# EAGLE design IrradiancePT_221211 (EAGLE 9.6.2)
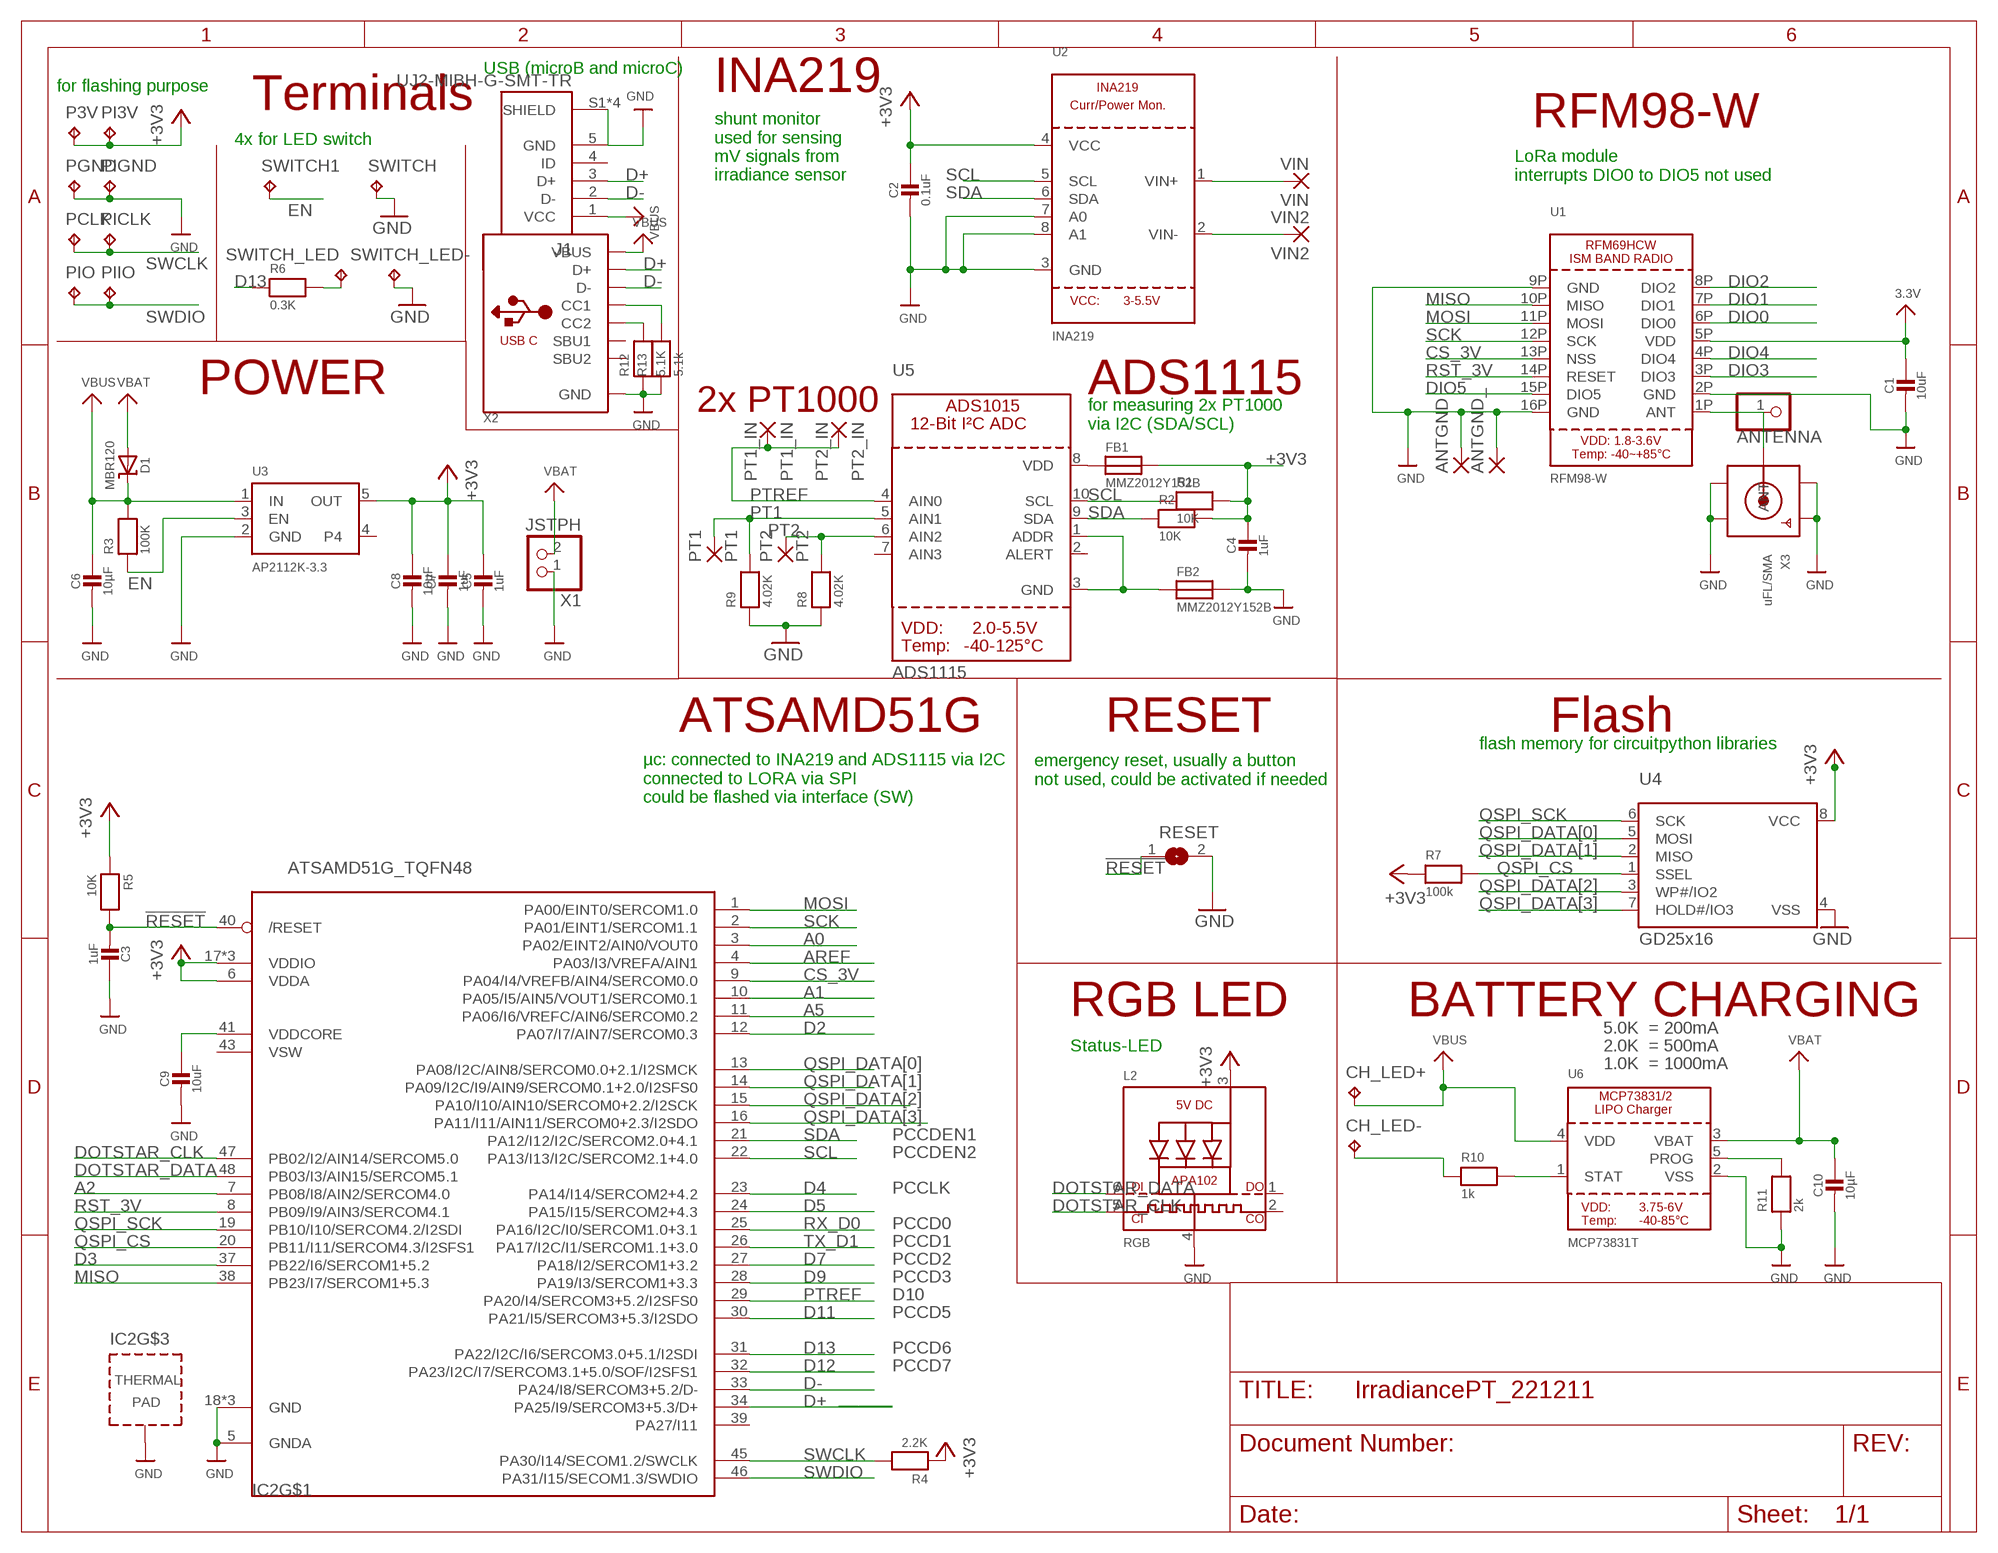
[diagram p0: schematic, sheet 1]

## Parts
ANTENNA  HEADER-1X1ROUND  [1X01_ROUND]
ANTGND  SMD5  [SMD2,54-5,08]
ANTGND_  SMD5  [SMD2,54-5,08]
C1  10uF  CAP_CERAMIC0805-NOOUTLINE  [0805-NO]
C2  0.1uF  CAP_CERAMIC0603_NO  [0603-NO]
C3  1uF  CAP_CERAMIC_0603MP  [_0603MP]
C4  1uF  CAP_CERAMIC0603_NO  [0603-NO]
C5  1uF  CAP_CERAMIC0603_NO  [0603-NO]
C6  10µF  CAP_CERAMIC0805-NOOUTLINE  [0805-NO]
C7  1uF  CAP_CERAMIC0603_NO  [0603-NO]
C8  10µF  CAP_CERAMIC0805-NOOUTLINE  [0805-NO]
C9  10uF  CAP_CERAMIC_0805MP  [_0805MP]
C10  10µF  CAP_CERAMIC0805-NOOUTLINE  [0805-NO]
CH_LED+  TPPAD1-13  [P1-13]
CH_LED-  TPPAD1-13  [P1-13]
D1  MBR120  DIODE-SCHOTTKYSOD-123  [SOD-123]
FB1  MMZ2012Y152B  FERRITE0805  [0805]
FB2  MMZ2012Y152B  FERRITE0805  [0805]
IC2  ATSAMD51G_TQFN48  [TQFN48_7MM]
J1  UJ2-MIBH-G-SMT-TR  [CUI_UJ2-MIBH-G-SMT-TR]
L2  RGB  APA1022020  [APA102_2020]
P3V  TPTP20R  [TP20R]
PCLK  TPTP20R  [TP20R]
PGND  TPTP20R  [TP20R]
PI3V  TPPAD1-13  [P1-13]
PICLK  TPPAD1-13  [P1-13]
PIGND  TPPAD1-13  [P1-13]
PIIO  TPPAD1-13  [P1-13]
PIO  TPTP20R  [TP20R]
PT1  PT1  1,6/0,9  [1,6/0,9]
PT1_IN  PT1_IN  1,6/0,9  [1,6/0,9]
PT2  PT2  1,6/0,9  [1,6/0,9]
PT2_IN  PT2_IN  1,6/0,9  [1,6/0,9]
R1  10K  RESISTOR0805  [0805]
R2  10K  RESISTOR0805  [0805]
R3  100K  RESISTOR0805  [0805]
R4  2.2K  RESISTOR0805  [0805]
R5  10K  RESISTOR0805  [0805]
R6  0.3K  RESISTOR0805  [0805]
R7  100k  RESISTOR0805  [0805]
R8  4.02K  RESISTOR0805  [0805]
R9  4.02K  RESISTOR0805  [0805]
R10  1k  RESISTOR0805  [0805]
R11  2k  RESISTOR0805  [0805]
R12  5.1K  RESISTOR0805  [0805]
R13  5.1k  RESISTOR0805  [0805]
RESET  SOLDERJUMPER  [SOLDERJUMPER_ARROW_NOPASTE]
SWITCH  TPPAD1-13  [P1-13]
SWITCH1  TPPAD1-13  [P1-13]
SWITCH_LED  TPPAD1-13  [P1-13]
SWITCH_LED-  TPPAD1-13  [P1-13]
U1  RFM98-W  RFM69HCW_SMT  [RFMHCW_SMT]
U2  INA219  [SOT23-8]
U3  AP2112K-3.3  VREG_SOT23-5  [SOT23-5]
U4  GD25x16  SPIFLASH_8PINUX  [USON8]
U5  ADS1115  ADC_ADS1015  [MSOP10]
U6  MCP73831T  MCP73831/2  [SOT23-5]
VIN  VIN  1,6/0,9  [1,6/0,9]
VIN2  VIN2  1,6/0,9  [1,6/0,9]
X1  JSTPH  CON_JST_PH_2PIN  [JSTPH2]
X2  USB_C  [USB_C_CUSB31-CFM2AX-01-X]
X3  uFL/SMA  SMACONNECTOR_EDGE_UFL  [SMA_EDGELAUNCH_UFL]

## Nets
!RESET: C3.2 IC2.40(/RESET) R5.2 RESET.1
+3V3: C1.1 C2.1 C4.1 C5.1 C7.1 C8.1 FB1.2 IC2.6(VDDA) IC2.17(VDDIO) IC2.36(VDDIO) IC2.44(VDDIO) L2.3(VDD) P3V.TP PI3V.TP R1.2 R2.2 R4.1 R5.1 R7.1 U1.5P(VDD) U2.4(VCC) U3.5(OUT) U4.8(VCC) ; supply symbol labelled 3.3V
A0: IC2.3(PA02/EINT2/AIN0/VOUT0)
A1: IC2.10(PA05/I5/AIN5/VOUT1/SERCOM0.1)
A2: IC2.7(PB08/I8/AIN2/SERCOM4.0)
A5: IC2.11(PA06/I6/VREFC/AIN6/SERCOM0.2)
AREF: IC2.4(PA03/I3/VREFA/AIN1)
CS_3V: IC2.9(PA04/I4/VREFB/AIN4/SERCOM0.0) U1.13P(NSS)
D2: IC2.12(PA07/I7/AIN7/SERCOM0.3)
D3: IC2.37(PB22/I6/SERCOM1+5.2)
D4: IC2.23(PA14/I14/SERCOM2+4.2)
D5: IC2.24(PA15/I15/SERCOM2+4.3)
D7: IC2.27(PA18/I2/SERCOM1+3.2)
D9: IC2.28(PA19/I3/SERCOM1+3.3)
D11: IC2.30(PA21/I5/SERCOM3+5.3/I2SDO)
D12: IC2.32(PA23/I2C/I7/SERCOM3.1+5.0/SOF/I2SFS1)
D13: IC2.31(PA22/I2C/I6/SERCOM3.0+5.1/I2SDI) R6.1
D+: IC2.34(PA25/I9/SERCOM3+5.3/D+) J1.3(D+) X2.A6(D+) X2.B6(D+)
D-: IC2.33(PA24/I8/SERCOM3+5.2/D-) J1.2(D-) X2.A7(D-) X2.B7(D-)
DIO0: U1.6P(DIO0)
DIO1: U1.7P(DIO1)
DIO2: U1.8P(DIO2)
DIO3: U1.3P(DIO3)
DIO4: U1.4P(DIO4)
DIO5: U1.15P(DIO5)
DOTSTAR_CLK: IC2.47(PB02/I2/AIN14/SERCOM5.0) L2.5(CKI)
DOTSTAR_DATA: IC2.48(PB03/I3/AIN15/SERCOM5.1) L2.6(DI)
EN: R3.1 SWITCH1.TP U3.3(EN)
GND: ANTGND.1(P) ANTGND_.1(P) C1.2 C2.2 C3.1 C4.2 C5.2 C6.2 C7.2 C8.2 C9.2 C10.2 FB2.2 IC2.5(GNDA) IC2.18(GND) IC2.35(GND) IC2.42(GND) IC2.THERMAL(TP) J1.5(GND) J1.S1(SHIELD) J1.S2(SHIELD) J1.S3(SHIELD) J1.S4(SHIELD) L2.4(GND) PGND.TP PIGND.TP R8.1 R9.1 R11.1 R12.1 R13.1 RESET.2 SWITCH.TP SWITCH_LED-.TP U1.2P(GND) U1.9P(GND) U1.16P(GND) U2.3(GND) U2.7(A0) U2.8(A1) U3.2(GND) U4.4(VSS) U6.2(VSS) X1.1 X2.A1B12(GND) X2.B1A12(GND) X3.GND@1(GND1) X3.GND@2(GND2) X3.GND@3(GND3) X3.GND@4(GND4)
GND_IN: FB2.1 U5.1(ADDR) U5.3(GND)
MISO: IC2.38(PB23/I7/SERCOM1+5.3) U1.10P(MISO)
MOSI: IC2.1(PA00/EINT0/SERCOM1.0) U1.11P(MOSI)
N$1: ANTENNA.1 U1.1P(ANT) X3.P(ANT)
N$2: R6.2 SWITCH_LED.TP
N$3: U2.1(VIN+) VIN.1(P)
N$4: U2.2(VIN-) VIN2.1(P)
N$5: FB1.1 U5.8(VDD)
N$6: CH_LED-.TP R10.1
N$7: R10.2 U6.1(STAT)
N$8: R11.2 U6.5(PROG)
N$9: R13.2 X2.A5(CC1)
N$10: R12.2 X2.B5(CC2)
PT1: PT1.1(P) R9.2 U5.5(AIN1)
PT2: PT2.1(P) R8.2 U5.6(AIN2)
PTREF: IC2.29(PA20/I4/SERCOM3+5.2/I2SFS0) PT1_IN.1(P) PT2_IN.1(P) U5.4(AIN0)
QSPI_CS: IC2.20(PB11/I11/SERCOM4.3/I2SFS1) R7.2 U4.1(SSEL)
QSPI_DATA[0]: IC2.13(PA08/I2C/AIN8/SERCOM0.0+2.1/I2SMCK) U4.5(MOSI)
QSPI_DATA[1]: IC2.14(PA09/I2C/I9/AIN9/SERCOM0.1+2.0/I2SFS0) U4.2(MISO)
QSPI_DATA[2]: IC2.15(PA10/I10/AIN10/SERCOM0+2.2/I2SCK) U4.3(WP#/IO2)
QSPI_DATA[3]: IC2.16(PA11/I11/AIN11/SERCOM0+2.3/I2SDO) U4.7(HOLD#/IO3)
QSPI_SCK: IC2.19(PB10/I10/SERCOM4.2/I2SDI) U4.6(SCK)
RST_3V: IC2.8(PB09/I9/AIN3/SERCOM4.1) U1.14P(RESET)
RX_D0: IC2.25(PA16/I2C/I0/SERCOM1.0+3.1)
SCK: IC2.2(PA01/EINT1/SERCOM1.1) U1.12P(SCK)
SCL: IC2.22(PA13/I13/I2C/SERCOM2.1+4.0) R1.1 U2.5(SCL) U5.10(SCL)
SDA: IC2.21(PA12/I12/I2C/SERCOM2.0+4.1) R2.1 U2.6(SDA) U5.9(SDA)
SWCLK: IC2.45(PA30/I14/SECOM1.2/SWCLK) PCLK.TP PICLK.TP R4.2
SWDIO: IC2.46(PA31/I15/SECOM1.3/SWDIO) PIIO.TP PIO.TP
TX_D1: IC2.26(PA17/I2C/I1/SERCOM1.1+3.0)
VBAT: C10.1 D1.A U6.3(VBAT) X1.2
VBUS: C6.1 CH_LED+.TP D1.C J1.1(VCC) R3.2 U3.1(IN) U6.4(VDD) X2.A4B9(VBUS) X2.B4A9(VBUS)
VDDCORE: C9.1 IC2.41(VDDCORE)
Unconnected: IC2.39(PA27/I11) J1.4(ID) L2.1(DO) L2.2(CKO) U3.4 U5.2(ALERT) U5.7(AIN3) X2.A8(SBU1) X2.B8(SBU2)

## Notes on the sheet
- USB (microB and microC)
- for flashing purpose | INA219
- Terminals
- RFM98-W
- 4x for LED switch
- shunt monitor
  used for sensing
  mV signals from
  irradiance sensor
- LoRa module
  interrupts DIO0 to DIO5 not used
- POWER | ADS1115
- 2x PT1000
- for measuring 2x PT1000
  via I2C (SDA/SCL)
- ATSAMD51G | RESET | Flash
- flash memory for circuitpython libraries
- emergency reset, usually a button
  not used, could be activated if needed
- µc: connected to INA219 and ADS1115 via I2C
  connected to LORA via SPI
  could be flashed via interface (SW)
- RGB LED | BATTERY CHARGING
- 5.0K  = 200mA
- Status-LED | 2.0K  = 500mA
- 1.0K  = 1000mA
- PCCDEN1
- PCCDEN2
- PCCLK
- PCCD0
- PCCD1
- PCCD2
- PCCD3
- D10
- PCCD5
- PCCD6
- PCCD7

## Power pins joined to a net without a drawn wire
VSW: IC2.43(VSW)

## Library data of the parts
ANTENNA = microbuilder:HEADER-1X1: PIN HEADER
ANTGND ANTGND_ = wirepad:SMD5: SMD PAD
C1-C10 = microbuilder:CAP_CERAMIC: Ceramic Capacitors For new designs, use the packages preceded by an '_' character since they are more reliable: The following footprints should be used on most boards: _0402 - Standard footprint for regular board layouts _0603 - Standard footprint for regular board layouts _0805 - Standard footprint for regular board layouts _1206 - Standard footprint for regular board layouts For extremely tight-pitch boards where space is at a premium, the following 'micro-pitch' footprints can be used (smaller pads, no silkscreen outline, etc.): _0402MP - Micro-pitch footprint for very dense/compact boards _0603MP - Micro-pitch footprint for very dense/compact boards _0805MP - Micro-pitch footprint for very dense/compact boards _1206MP - Micro-pitch footprint for very dense/compact boards
CH_LED+ CH_LED- P3V PCLK PGND PI3V PICLK PIGND PIIO PIO SWITCH SWITCH1 SWITCH_LED SWITCH_LED- = testpad:TP: Test pad
D1 = microbuilder:DIODE-SCHOTTKY
FB1 FB2 = microbuilder:FERRITE: Ferrite Bead 0603 MMZ1608B121C - 120 Ohm, 600mA Ferrite Chip - Digikey: 445-2164-1-ND BK1608HW121-T - 120 Ohm, 600mA Ferrite Chip - Digikey: 587-1876-2-ND 0805 HZ0805B272R-10 - 2.7K Ohm @ 100MHz, 200mA 0.8 Ohm DC Resistance - Digikey: 240-2504-1-ND (see also Murata BLM21BD272SN1L)
IC2 = microbuilder:ATSAMD51G
J1 = cui-uj2:UJ2-MIBH-G-SMT-TR: USB micro B type receptacle; MANUFACTURER: CUI; MAXIMUM_PACKAGE_HEIGHT: 2.95 mm; PARTREV: 1.0; STANDARD: Manufacturer Recommendations
L2 = microbuilder:APA102: APA102/DotStar Pixels VCC: 5V DC Refresh Rate: 400Hz
PT1 PT1_IN PT2 PT2_IN VIN VIN2 = wirepad:1,6/0,9: THROUGH-HOLE PAD
R1-R13 = microbuilder:RESISTOR: Resistors 0402 - 0402 Surface Mount Package 22 Ohm 1% 1/16W [Digikey: 311-22.0LRTR-ND] 33 Ohm 5% 1/16W 1.0K 5% 1/16W 1.5K 5% 1/16W 2.0K 1% 1/16W 10.0K 1% 1/16W [Digikey: 311-10.0KLRTR-ND] 10.0K 5% 1/16W [Digikey: RMCF0402JT10K0TR-ND] 12.1K 1% 1/16W [Digikey: 311-22.0LRTR-ND] 100.0K 5% 1/16W 0603 - 0603 Surface Mount Package 0 Ohm 1/10 Watt 1% Resistor 15 Ohm 1/10 Watt 1% Resistor 33 Ohm 1/10 Watt 1% Resistor 49.9 Ohm 1/10 Watt 1% Resistor 100 Ohm 1/10 Watt 1% Resistor 150 Ohm 1/10 Watt 1% Resistor 240 Ohm 1/10 Watt 1% Resistor 390 Ohm 1/10 Watt 1% Resistor 560 Ohm 1/10 Watt 1% Resistor 680 Ohm 1/10 Watt 1% Resistor 750 Ohm 1/10 Watt 1% Resistor 1.0K Ohm 1/10 Watt 1% Resistor 1.5K Ohm 1/10 Watt 1% Resistor 2.0K Ohm 1/10 Watt 1% Resistor 2.2K Ohm 1/10 Watt 1% Resistor 3.3K Ohm 1/10 Watt 1% Resistor 4.7K Ohm 1/10 Watt 1% Resistor 10.0K Ohm 1/10 Watt 1% Resistor 12.0K Ohm 1/10 Watt 1% Resistor 12.1K Ohm 1/10 Watt 1% Resistor 20.0K Ohm 1/10 Watt 1% Resistor 33.0K Ohm 1/10 Watt 1% Resistor 100.0K Ohm 1/10 Watt 1% Resistor 0805 - 0805 Surface Mount Package 0 Ohm 1/8 Watt 1% Resistor 33 Ohm 1/8 Watt 1% Resistor 100 Ohm 1/8 Watt 1% Resistor 150 Ohm 1/8 Watt 1% Resistor 200 Ohm 1/8 Watt 1% Resistor 240 Ohm 1/8 Watt 1% Resistor 330 Ohm 1/8 Watt 1% Resistor 390 Ohm 1/8 Watt 1% Resistor 470 Ohm 1/8 Watt 1% Resistor 1.0K Ohm 1/8 Watt 1% Resistor 1.5K Ohm 1/8 Watt 1% Resistor 2.0K Ohm 1/8 Watt 1% Resistor 4.7K Ohm 1/8 Watt 1% Resistor 5.1K Ohm 1/8 Watt 1% Resistor 5.6K Ohm 1/8 Watt 1% Resistor 10.0K Ohm 1/8 Watt 1% Resistor 22.0K Ohm 1/8 Watt 1% Resistor 33.0K Ohm 1/8 Watt 1% Resistor 100K Ohm 1/8 Watt 1% Resistor 1206 - 1206 Surface Mount Package 2012 - 2010 Surface Mount Package 0.11 Ohm 1/2 Watt 1% Resistor - Digikey: RHM.11UCT-ND
RESET = microbuilder:SOLDERJUMPER: SMD Solder JUMPER Solder the two pads together to create a connection, or remove the solder to break it. REFLOW - Use this footprint for solder paste and reflow ovens. WAVE - Use this footprint for hand-soldering (larger pads). CLOSED - Has a trace between the two pads to ensure it is closed by default. The trace needs to be cut to disable the jumper, and can be closed again by creating a solder bridge between the two pads.; BOM: EXCLUDE
U1 = microbuilder:RFM69HCW: RFM69HCW - ISM Band RF Transceiver
U2 = microbuilder:INA219: INA219 - I2C Current/Power Monitor Voltage Range: 0-26V Accuracy: 0.5% Temperature: -40°C - 125°C
U3 = microbuilder:VREG_SOT23-5: SOT23-5 Fixed Voltage Regulators Part Current Out V Out V In V Dropout θJA (°C/W) TJ (°C) Digikey Part No. ADP121 150mA 3.3V 3.4-5.5V 0.09V @ 150mA -- -- ADP121-AUJZ33R7CT-ND ADP121 150mA 3.0V 3.1-5.5V 0.09V @ 150mA -- -- ADP121-AUJZ30R7CT-ND ADP122 300mA 3.3V 3.4-5.5V 0.085V @ 300mA -- -- ADP122AUJZ-3.3-R7CT-ND ADP1712 300mA 3.3V 3.5-5.5V 0.17V @ 300mA -- -- ADP1712AUJZ-3.3-R7TR-ND AP7311 (Low Cost) 150mA 3.3V 3.5-6V 0.15V @ 150mA -- -- AP7311-33WG-7DICT-ND LD39015M18R 150mA 1.8V 1.9V-5.5V 0.08V @ 100mA -- -- 497-6977-1-ND LP2985A-33DBVR 150mA 3.3V 3.3-16V 0.28V @ 150mA 206 150 296-18479-1-ND MCP1824T-3302E/OT 300mA 3.3V 3.5V-6V 0.2V @ 300mA -- -- MCP1824T-3302E/OTCT-ND MIC5205-2.5YM5 TR 150mA 2.5V 2.7-16V 0.165V @ 150mA -- -- 576-1257-2-ND MIC5205-3.0YM5 TR 150mA 3.0V 3.2V-16V 0.165V @ 150mA -- -- 576-1258-2-ND MIC5205-3.3YM5 TR 150mA 3.3V 3.5V-16V 0.165V @ 150mA -- -- 576-1259-2-ND TPS780330220 150mA 3.3V+2.2V 3.6-5.5V 250mV Max -- -- 296-23332-1-ND TDA3663/N1,135 100mA 3.3V 3.5-45V 0.18V @ 50mA -- -- 568-5343-1-ND Max operating temp can be calculated using θJA, TJ (max junction temperature), and power in watts. Set the "Maximum Ambient Temperature" until it reaches TJ ("Max Junction Temperature"), which is the absolute limit for safe use of the regulator: Heat Sink Temperature Calculator <http://www.daycounter.com/Calculators/Heat-Sink-Temperature-Calculator.phtml> For example, With 12V source into a 3.3V LP2985 and a 30mA load, we are dissipating (12V-3.3V) * 0.03A = 0.261W. With a θJA of 206 °C/W, a TJ of 150°C, and 261mW we can safely use the chip without a heat sink up to 75°C (=147.1°C Junction Temperature).
U4 = microbuilder:SPIFLASH_8PIN: SOIC8 SPI Flash Be careful with the size since SOIC8 flash comes in several 'widths' SOIC8 150 mil M25P16 - 16Mbit (2Mbit x 8) Serial Flash (75MHz SPI Bus), Supply: 2.7-3.6V Digikey: SOIC8 - M25P16-VMN6P-ND SOIC8 208 mil W25Q16BVSSIG - 16Mbit (2Mbit x 8) Serial Flash (104MHz SPI Bus), Supply: 2.7-3.6V Digikey: SOIC8 - W25Q16BVSSIG-ND
U5 = microbuilder:ADC_ADS1015: ADS1015 - 12-bit 4-Channel I2C ADC with Internal PGA VDD: 2.0-5.5V Sampling Rate: 3.3ksps Gain Settings: 2/3, 1, 2, 4, 8, 16 I2C Address: ADDR low = 1001000x, ADDR high = 1001001x Internal Comparator The ADS1015 includes an internal comparator that can be set to output a high-level on ALERT when the conversion results exceeeds a pre-defined upper level, and will deassert itself when the level falls below a pre-defined lower threshold level. It can also be set to windowed mode where the ALERT pin will be asserted if the data exceeds the upper threshold or falls below the lower threshold.
U6 = microbuilder:MCP73831/2: MCP73831/2 LIPO Charger VDD: 3.75 - 6V Temp -40 - 85°C Programmable Charge Rate: 15-500mA NOTE: STAT is a tri-state logic output on the MCP73831 and an open-drain output on the MCP73832. SOT23-5 with 4.2V output and tri-state logic on STAT = MCP73831T-2ACI/OT
X1 = microbuilder:CON_JST_PH_2PIN: JST 2-Pin Right-Angle Connector PH-Series - 4UConnector: 17311 SH-Series - 4UConnector: 07278
X2 = microbuilder:USB_C: USB Type-C USB 2.0 Connector
X3 = microbuilder:SMACONNECTOR: SMA Connector 90° DIP SMA Connector, 50 Ohm (4UConnector: 07259)

## Board
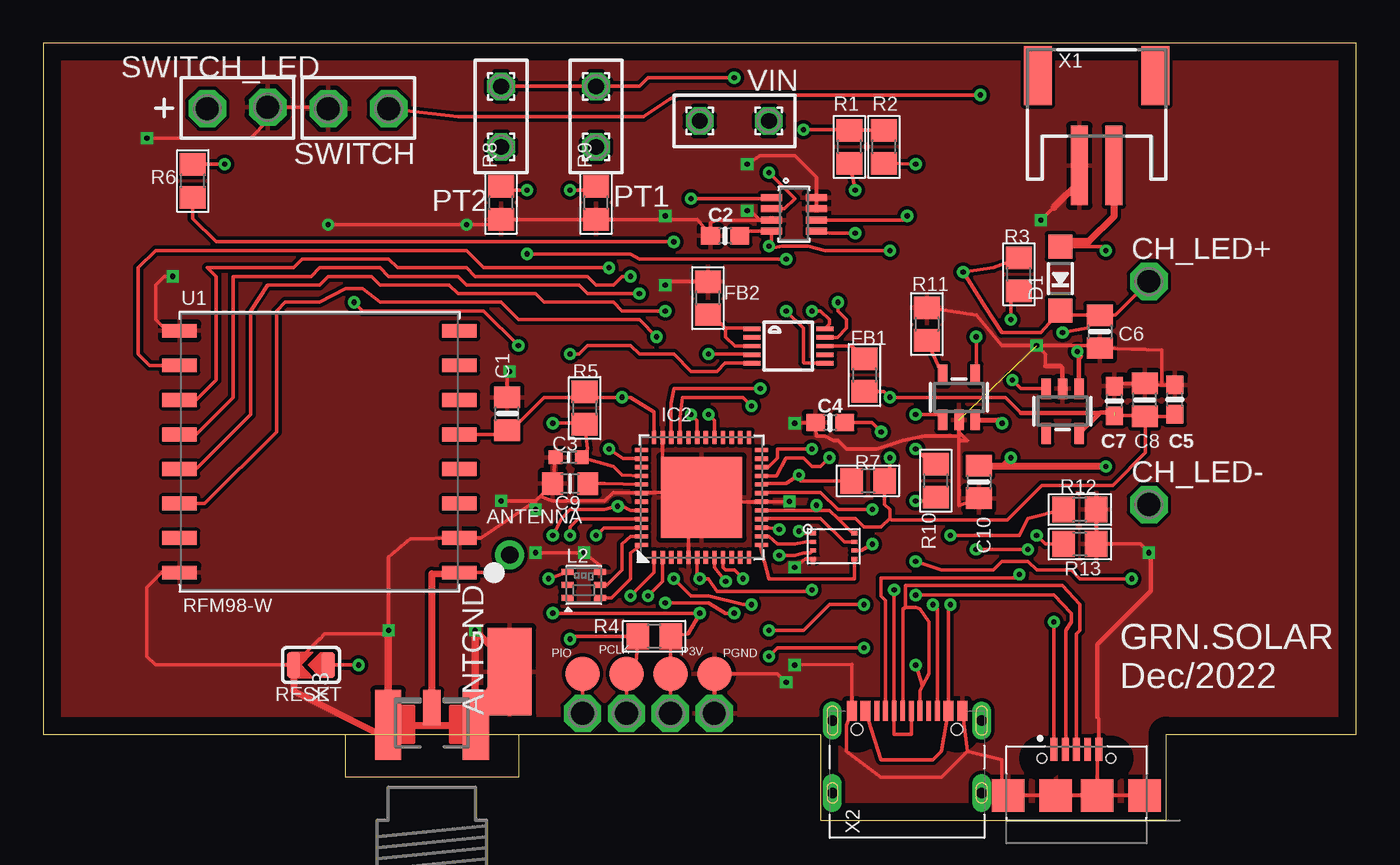
[diagram p1: board, top side]
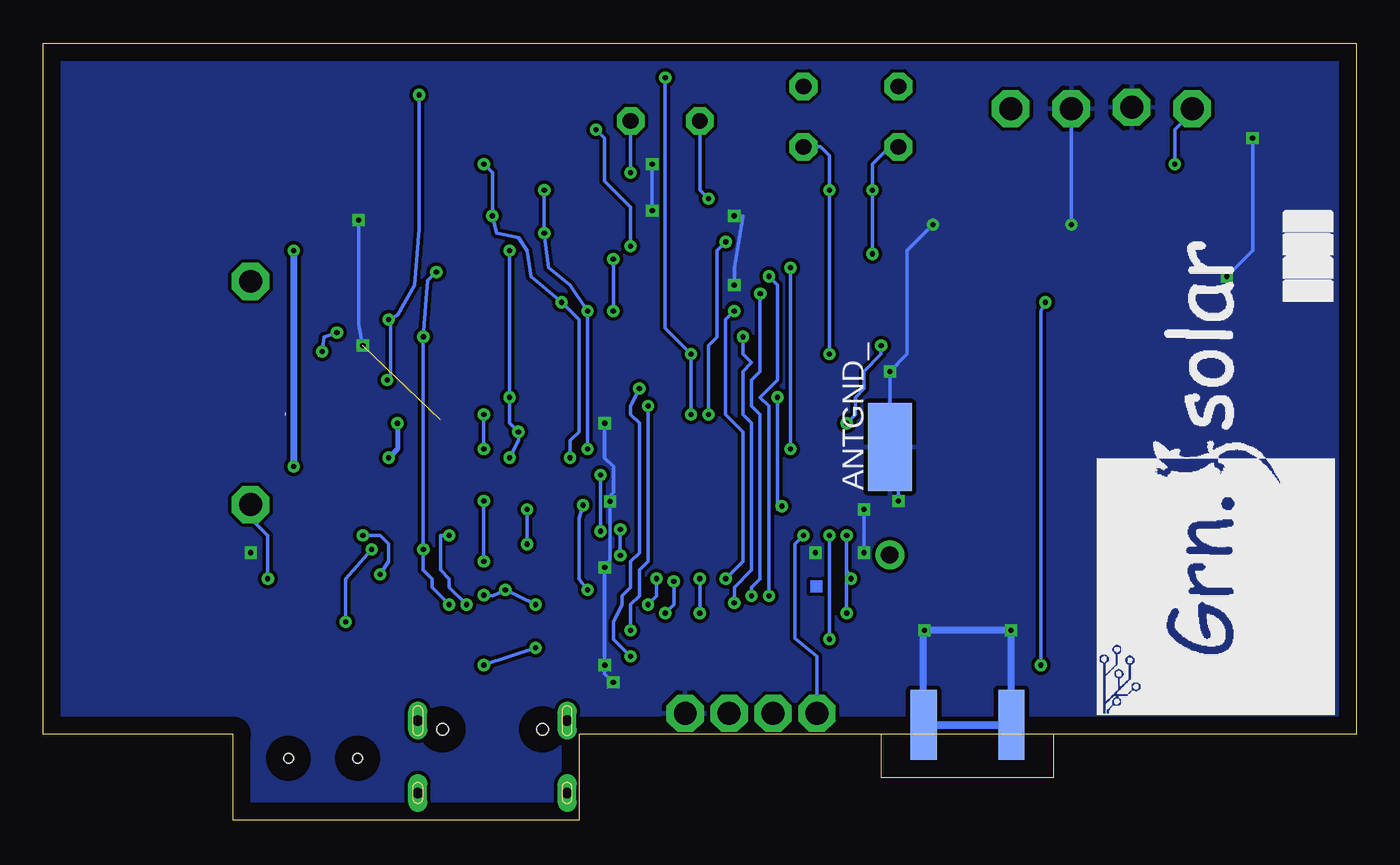
[diagram p2: board, bottom side, seen from below]

Size 76 x 45 mm. Coordinates in mm from the lower left corner, seen from the top.
Outline: 17.5,5 0,5 0,45 76,45 76,5 65,5 65,0 45,0 45,5 27.5,5
Outline: 17.5,5 27.5,5
Outline: 27.5,5 27.5,2.5 17.5,2.5 17.5,5
Copper layers (1*16): Top 0.035mm / dielectric 1.5mm / Bottom 0.035mm
Design rules "default *": minimum track width 10mil, minimum drill 24mil, track to track 8mil, track to pad 8mil, pad to pad 8mil, via to via 8mil, smd to smd 8mil, copper to edge 40mil, drill to drill 8mil, minimum pad ring 10mil, minimum via ring 8mil, stop-mask expansion 4mil, vias tented up to drill 0mil, thermal gap 10mil

### Footprints (pad centres in the part's own frame; a part is rotated, then mirrored left to right if it is on the bottom)
1X01_ROUND = drill 1 pad 1.676: 1 0,0
SMD2,54-5,08 = smd 2.54 x 5.08: 1 0,0
0805-NO = smd 1.24 x 1.5: 1 -0.95,0; 2 0.95,0
0603-NO = smd 1.075 x 1: 1 -0.85,0; 2 0.85,0
_0603MP = smd 0.8 x 0.8: 1 -0.762,0; 2 0.762,0
_0805MP = smd 1.2 x 1.3: 1 -1.016,0; 2 1.016,0
P1-13 = drill 1.321 pad 2.159 octagon: TP 0,0
SOD-123 = smd 1.4 x 1.4: A 1.85,0; C -1.85,0
0805 = smd 1.3 x 1.5: 1 -0.95,0; 2 0.95,0
TQFN48_7MM = smd 0.25 x 0.75: 1 -2.75,-3.475; 2 -2.25,-3.475; 3 -1.75,-3.475; 4 -1.25,-3.475; 5 -0.75,-3.475; 6 -0.25,-3.475; 7 0.25,-3.475; 8 0.75,-3.475; 9 1.25,-3.475; 10 1.75,-3.475; 11 2.25,-3.475; 12 2.75,-3.475; 25 2.75,3.475; 26 2.25,3.475; 27 1.75,3.475; 28 1.25,3.475; 29 0.75,3.475; 30 0.25,3.475; 31 -0.25,3.475; 32 -0.75,3.475; 33 -1.25,3.475; 34 -1.75,3.475; 35 -2.25,3.475; 36 -2.75,3.475 | smd 0.75 x 0.25: 13 3.475,-2.75; 14 3.475,-2.25; 15 3.475,-1.75; 16 3.475,-1.25; 17 3.475,-0.75; 18 3.475,-0.25; 19 3.475,0.25; 20 3.475,0.75; 21 3.475,1.25; 22 3.475,1.75; 23 3.475,2.25; 24 3.475,2.75; 37 -3.475,2.75; 38 -3.475,2.25; 39 -3.475,1.75; 40 -3.475,1.25; 41 -3.475,0.75; 42 -3.475,0.25; 43 -3.475,-0.25; 44 -3.475,-0.75; 45 -3.475,-1.25; 46 -3.475,-1.75; 47 -3.475,-2.25; 48 -3.475,-2.75 | smd 4.7 x 4.7: THERMAL 0,0
CUI_UJ2-MIBH-G-SMT-TR = smd 0.4 x 1.35: 1 -1.3,2.675; 2 -0.65,2.675; 3 0,2.675; 4 0.65,2.675; 5 1.3,2.675 | smd 1.9 x 1.9: S1 -3.95,0; S2 -1.2,0; S3 1.2,0; S4 3.95,0 | hole 0.55: -2,2.15; 2,2.15
APA102_2020 = smd 0.7 x 0.35: 1 -0.95,-0.75; 2 -0.95,0; 3 -0.95,0.75; 4 0.95,0.75; 5 0.95,0; 6 0.95,-0.75
TP20R = smd 2 x 2: TP 0,0
1,6/0,9 = drill 0.914 pad 1.6 octagon: 1 0,0
SOLDERJUMPER_ARROW_NOPASTE = smd 0.762 x 1.524: 1 -1.016,0; 2 1.016,0
RFMHCW_SMT = smd 2 x 0.8: 1P 8.1,-7; 2P 8.1,-5; 3P 8.1,-3; 4P 8.1,-1; 5P 8.1,1; 6P 8.1,3; 7P 8.1,5; 8P 8.1,7; 9P -8.1,7; 10P -8.1,5; 11P -8.1,3; 12P -8.1,1; 13P -8.1,-1; 14P -8.1,-3; 15P -8.1,-5; 16P -8.1,-7
SOT23-8 = smd 0.4 x 1.2: 1 -0.975,-1.3; 2 -0.325,-1.3; 3 0.325,-1.3; 4 0.975,-1.3; 5 0.975,1.3; 6 0.325,1.3; 7 -0.325,1.3; 8 -0.975,1.3
SOT23-5 = smd 0.55 x 1.2: 1 -0.95,-1.3; 2 0,-1.3; 3 0.95,-1.3; 4 0.95,1.3; 5 -0.95,1.3
USON8 = smd 0.35 x 0.25: 1 -1.2,0.75; 2 -1.2,0.25; 3 -1.2,-0.25; 4 -1.2,-0.75; 5 1.2,-0.75; 6 1.2,-0.25; 7 1.2,0.25; 8 1.2,0.75
MSOP10 = smd 0.25 x 1: 1 -1,-2.113; 2 -0.5,-2.113; 3 0,-2.113; 4 0.5,-2.113; 5 1,-2.113; 6 1,2.113; 7 0.5,2.113; 8 0,2.113; 9 -0.5,2.113; 10 -1,2.113
JSTPH2 = smd 1 x 4.6: 1 -1,-3.7; 2 1,-3.7 | smd 1.6 x 3.4: NC1 -3.4,1.5; NC2 3.4,1.5
USB_C_CUSB31-CFM2AX-01-X = smd 0.575 x 1.15: A1B12 -3.2,7.355; A4B9 -2.4,7.355; B1A12 3.2,7.355; B4A9 2.4,7.355 | smd 0.275 x 1.15: A5 -1.25,7.355; A6 -0.25,7.355; A7 0.25,7.355; A8 1.25,7.355; B5 1.75,7.355; B6 0.75,7.355; B7 -0.75,7.355; B8 -1.75,7.355 | drill 0.6 pad 1 long: M1 -4.32,6.78; M2 4.32,6.78; M3 -4.32,2.6; M4 4.32,2.6 | hole 0.65: 2.89,6.28; -2.89,6.28
SMA_EDGELAUNCH_UFL = smd 4.064 x 1.524: GND@1 2.032,-2.54; GND@2 2.032,2.54 | smd 4.064 x 1.524 bottom: GND@3 2.032,2.54; GND@4 2.032,-2.54 | smd 2.032 x 1.016: P 3.048,0

### Placement (x,y rotation side)
ANTENNA  27,15.37 0 top
ANTGND  27,8.62 0 top
ANTGND_  27,21.62 0 bottom
C1  26.85,23.55 90 top
C2  39.47,33.85 180 top
C3  30.41,21.03 0 top
C4  45.55,23.04 180 top
C5  65.5,24.37 90 top
C6  61.15,28.3 270 top
C7  62,24.29 90 top
C8  63.75,24.35 90 top
C9  30.5,19.5 180 top
C10  54.15,19.6 270 top
CH_LED+  64,31.21 0 top
CH_LED-  64,18.29 0 top
D1  58.87,31.37 90 top
FB1  47.53,25.79 270 top
FB2  38.47,30.24 90 top
IC2  38.1,18.7 0 top
J1  59.8,1.45 0 top
L2  31.29,13.63 0 top
P3V  36.3,8.5 0 top
PCLK  33.76,8.5 0 top
PGND  38.84,8.5 0 top
PI3V  36.3,6.2 0 top
PICLK  33.76,6.2 0 top
PIGND  38.84,6.2 0 top
PIIO  31.22,6.2 0 top
PIO  31.22,8.5 0 top
PT1  32,39 0 top
PT1_IN  32,42.5 0 top
PT2  26.5,39 0 top
PT2_IN  26.5,42.5 0 top
R1  46.66,39 90 top
R2  48.66,39 90 top
R3  56.47,31.62 90 top
R4  35.36,10.66 180 top
R5  31.34,23.88 270 top
R6  8.66,37.02 90 top
R7  47.74,19.66 180 top
R8  26.5,35.75 90 top
R9  32,35.75 90 top
R10  51.66,19.67 90 top
R11  51.15,28.74 270 top
R12  60,18 180 top
R13  60,16 180 top
RESET  15.5,9 180 top
SWITCH  16.5,41.21 0 top
SWITCH1  20,41.21 0 top
SWITCH_LED  9.5,41.21 0 top
SWITCH_LED-  13,41.29 0 top
U1  15.99,21.35 0 top
U2  43.45,35.09 270 top
U3  59,23.7 180 top
U4  45.75,15.88 0 top
U5  43.13,27.47 270 top
U6  53,24.5 0 top
VIN  38,40.5 0 top
VIN2  42,40.5 0 top
X1  60.97,41.62 0 top
X2  50,-1 0 top
X3  22.5,3.5 90 top

### Tracks (layer width: path | path; a pad name or v marks a point on that pad's centre or on a via)
!RESET  (via drill 0.3)
  Top 0.2: 31.47,22.8 R5.2 | RESET.1 v18.25,9 | v18,30 18.5,29.5 25.5,29.5 v27.5,27.5 | v29.5,23 31.27,23 R5.2 | IC2.40 33.5,20 33,20.5 C3.2 31.5,21.5 R5.2
  Bottom 0.2: v18.25,9 18.25,29.5 v18,30 | v27.5,27.5 27.5,27 28.5,26 28.5,25 29,24.5 29,23.5 v29.5,23
+3V3  (via drill 0.3)  (1 unrouted)
  Top 0.2: PI3V.TP P3V.TP 36.3,10.62 R4.1 37.31,10.81 v38,12 v29.5,12 | U4.8 46.87,16.63 46,17.5 | 46,17.5 45.5,17.95 44.5,17.95 | 44.5,17.95 IC2.17 | 49,17.5 49,18 48.69,18.31 R7.1 49,20.47 v49,21 | 49,17.5 48.5,17 47.5,17 47,17.5 46,17.5 | IC2.44 34,17.95 33.5,18.2 v33.25,18.2 32.5,18 30.5,18 30,17.5 v29.5,16.5 | IC2.6 37.85,14.15 v38,14 38.5,14 39,13.25 44.5,13.25 v44.5,13.35 | v44.75,18.25 44.85,18.35 44.5,17.95 | C4.1 47.96,23.04 v48.5,22.5 | FB1.2 48.66,24.84 v49,24.5 55.7,24.5 56.6,23.6 | IC2.36 35.35,23.65 34,24.5 v33.5,24.5 31.67,24.5 R5.1 31.01,24.5 29,24.5 27.1,22.6 C1.1 26.6,22.35 U1.5P | C2.1 40.59,34.12 U2.4 42.15,33.15 | R2.2 R1.2 46.61,40 v44,40 | 42.15,33.15 v42,33.25 | L2.3 v29.25,14 | 42.15,33.15 42.75,33.25 44.25,33.25 45.25,33 v49,33 | 63.7,23.2 63.8,23.3 63.8,21.3 61.9,19.4 57.8,19.4 55.8,17.4 49.1,17.4 49,17.5 | C7.1 63.75,23.44 C8.1 65.5,23.4 C5.1
  Top 0.254: U3.5 61.15,23.6 | 62,23.63 61.18,23.63 61.15,23.6 | 56.6,23.6 61.15,23.6
  Bottom 0.2: v38,14 v38,12 | v29.5,12 29.5,14.5 | 29.5,14.5 v29.5,16.5 | v44.75,18.25 45,17.5 45,14 v44.5,13.35 | v49,21 48.5,22 v48.5,22.5 49,23 v49,24.5 v49,33 | v33.5,24.5 33.5,18 v33.25,18.2 | v42,33.25 42,35.5 43.5,37 43.5,39.5 v44,40 | v29.25,14 29.5,14.5
CS_3V  (via drill 0.3)
  Top 0.2: U1.13P 8.85,20.35 12,23.5 12,29.5 13,31 16,31 16.5,31.5 19,31.5 19.5,31 23.5,31 24,30.5 28.5,30.5 29,30 33,30 33.5,29.5 v36,29.5 | IC2.9 39.35,14.65 39.5,14.5 40,14.5 v40.5,14 | v41,12.5 40.5,12.5 38.5,13 37.5,13 v36.5,14
  Bottom 0.2: v36,29.5 36.5,29 36.5,23.5 35.5,22.5 35.5,15 v36.5,14 | v40.5,14 40.5,13 v41,12.5
D13  (via drill 0.3)
  Top 0.2: IC2.31 37.85,23.15 v37.5,23.5 | R6.1 8.66,34.84 10,33.5 v36.5,33.5
  Bottom 0.2: v37.5,23.5 37.5,27.5 37,28 37,33 v36.5,33.5
D+  (via drill 0.3)
  Top 0.2: X2.A6 49.75,12.25 49.9,12.35 | 49.9,12.35 50.5,12.35 50.75,12.25 51.25,11.5 51.25,8.5 50.9,7.8 | 49.9,12.35 49.9,13.6 59,13.6 60,12.5 60,11 59.8,10.8 J1.3 | IC2.34 36.35,24.15 36.5,25 v41.5,25 | X2.B6 50.75,7.5 50.9,7.8 | v42,9.5 42.5,10 v47.5,10 | v50.5,9 50.9,7.8
  Bottom 0.2: v41.5,25 42,24 42,23.5 41.5,23 41.5,15.5 42,15 42,13.5 42.5,13 42.5,12.5 43,11.5 43,10.5 v42,9.5 | v47.5,10 v50.5,9
D-  (via drill 0.3)
  Top 0.2: v50.5,13.05 58.5,13.05 59.5,12 59.5,11.5 59.2,11 59.2,4.12 J1.2 | v49.25,13.35 X2.B7 49.25,5 50.25,5 X2.A7 | IC2.33 36.85,23.35 37,24.5 40.5,24.5 v41,24 | v47.5,12.5 45.5,12.5 44,11 v42,11
  Bottom 0.2: v50.5,13.05 50,13 v49.25,13.35 v47.5,12.5 | v41,24 41,15 41.5,14.5 41.5,13 42,12.5 v42,11
DOTSTAR_CLK
  Top 0.2: L2.5 32.63,13.63 33.5,14.5 33.5,16 34,16.45 IC2.47
DOTSTAR_DATA
  Top 0.2: L2.6 32.88,12.88 34,14 34,15.5 IC2.48
EN  (via drill 0.3)
  Top 0.2: v56,29 56,30.2 R3.1 | SWITCH1.TP 24,40.75 34.75,40.75 36.25,41.75 36.75,42 v54.25,42 | v56.1,25.5 56.6,25 U3.3
  Bottom 0.2: v56.1,25.5 55.9,25.7 55.9,28.9 v56,29 55.5,29.25 54.5,31 54.25,34.25 v54.25,42
GND  (via drill 0.3)  (1 unrouted)
  Top 0.2: U4.4 44.13,15.13 v43.5,14.65 | PGND.TP 42.5,8.5 v43,8 | R12.1 R13.1 63.5,16 v64,15.5 | IC2.5 37.35,17.95 IC2.THERMAL | IC2.THERMAL 38.35,18.45 IC2.18 v43.2,18.48 | IC2.THERMAL 36.5,18.7 | 36.5,18.7 36.3,18.7 36,19 34.67,19 IC2.42 33,19 32.5,18.5 29.5,18.5 28.75,18.75 | v43.5,23 44.66,23 C4.2 44.75,22.25 45.25,22.25 45.75,22 46,22 46.5,21.5 48.25,21.5 49.75,22 51,22.25 53,22.25 | U1.9P 7.15,28.35 6.5,29 6.5,31 7,31.5 v7.5,31.5 | U1.16P 6.85,14.35 6,13.5 6,9.5 6.5,9 RESET.2 15.98,10.5 16,10.5 16.3,10.8 19.8,10.8 v20,11 20,15.25 21.25,16.3 U1.2P 25.35,16.35 28.5,18.5 | ANTGND.1 26.38,8.62 | L2.4 32.24,14.76 v31.3,15.5 v28.5,15.5 | 28.5,18.5 v26.5,18.5 | IC2.35 35.85,19.35 36.5,18.7 | C1.2 26.85,25.85 v27,26 | 36,34.8 R9.1 R8.1 26.2,34.5 v24.5,34.5 v16.5,34.5 | 36,34.8 37.86,34.8 C2.2 38.62,34.62 39,34.75 41.5,34.75 | 41.5,34.75 41.91,34.75 U2.3 | FB2.2 36.19,31.19 v36,31 | v36,35 36,34.8 | U2.8 U2.7 44.75,37.25 43.5,38.5 41.5,38.5 v40.75,38 | v40.75,35.3 41,35.25 41.5,34.75 | SWITCH.TP 16.42,41.29 SWITCH_LED-.TP 13,40.5 12,39.5 v6,39.5 | C5.2 64.75,25.22 | 64.75,25.22 63.75,25.22 C8.2 62,25.3 C7.2 | v57.5,27.5 58,27 58,26.3 | v57.5,27.5 61,27.5 C6.2 64.75,27.25 64.75,25.22 | C3.1 C9.2 28.75,18.75 | 28.75,18.75 28.5,18.5 | v28.5,18 28.5,18.5 | 53.5,4 55.5,3.5 55.5,1.8 J1.S1 J1.S2 J1.S3 | 53.5,4 X2.B1A12 | v43.5,9 46.8,9.05 X2.A1B12 46.5,5.5 46.5,4 48.5,2.5 52,2.5 53.5,4 | R11.1 54,29.25 55.5,27.5 v57.5,27.5 | v57.75,34.75 58.5,35.5 | 53,22 53.5,22 53,22.5 U6.2 53,22.25 | 53,22 53,18.25 C10.2 | 53,22 53,22.25 | J1.S3 61,4.12 J1.5 61.1,5.9 61,6 | J1.S3 J1.S4
  Top 0.254: U3.2 59,26.2 58.9,26.3 58,26.3 | PIGND.TP PGND.TP | 61,6 61,10.2 64.1,13.3 64.1,15.4 v64,15.5
  Top 0.4: X1.1 59.97,36.97 58.5,35.5 | RESET.2 14.48,7.52 14.5,7.5 19.5,5 20,5.5 | 20,5.5 25,5.5 v25,11 | X3.GND@4 26.97,8.03 27,8 27,9 v25,11 | X3.GND@4 25.04,10.96 v25,11 | X3.GND@3 19.96,10.96 v20,11 20,5.5 | 26.38,8.62 25.04,6.12 X3.GND@4
  Bottom 0.2: v43,8 43.5,8.5 v43.5,9 v43.5,14.65 43.25,15 43.2,15.15 v43.2,18.48 43.2,18.8 43,19 43,20.5 43.5,21 v43.5,23 | v26.5,18.5 26.5,19.5 27.38,21.62 ANTGND_.1 v27,26 26,27 26,33 v24.5,34.5 | v36,31 36,32 35.5,35 v36,35 | v40.75,38 v40.75,35.3 | v16.5,34.5 SWITCH.TP | v6,39.5 6,33 v7.5,31.5 | v28.5,15.5 v28.5,18 | v57.5,27.5 57.75,28.75 v57.75,34.75
  Bottom 0.4: v20,11 20,5.5 25,5.5 24.97,5.53 X3.GND@3 19.96,10.96 v20,11 | X3.GND@4 25.04,10.96 v25,11 v20,11
  pour Top: 0,45 76,45 76,5 65,5 65,0 45,0 45,5 0,5
  pour Bottom: 0,45 76,45 76,5 65,5 65,0 45,0 45,5 0,5
GND_IN
  Top 0.2: FB2.1 38.71,29.29 39.5,28.5 | 39.5,28.5 40.99,28.5 U5.1 | U5.3 40.03,27.47 39.5,28 39.5,28.5
MISO  (via drill 0.3)
  Top 0.2: IC2.38 33.55,20.95 v32.75,21.5 | U1.10P 6.15,26.35 5.5,27 5.5,32 6.5,33 24.5,33 25.5,32 v32.75,32
  Bottom 0.2: v32.75,32 v32.75,21.5
MOSI  (via drill 0.3)
  Top 0.2: U1.11P 8.85,24.35 10,25.5 10,31.5 9.5,32 14.5,32 15,32.5 20,32.5 20.5,32 24.5,32 25,31.5 31.5,31.5 32,31 33,31 33.5,31.5 v34,31.5 | IC2.1 35.35,14.35 v34,13
  Bottom 0.2: v34,13 34,24 34.5,24.5 33.5,25.5 33.5,31 v34,31.5
N$1
  Top 0.2: U1.1P 26.38,14.35 ANTENNA.1
  Top 0.4: X3.P 22.5,14.3 24.1,14.24 U1.1P
N$2  (via drill 0.3)
  Top 0.2: v10.5,38 8.69,38 R6.2
  Bottom 0.2: SWITCH_LED.TP 9.5,41 10.5,40 v10.5,38
N$3  (via drill 0.3)
  Top 0.2: v37.5,36 42.09,36 U2.1
  Bottom 0.2: VIN.1 38,36.5 v37.5,36
N$4  (via drill 0.3)
  Top 0.2: U2.2 42.91,35.41 43.5,36 v42,37.5
  Bottom 0.2: v42,37.5 VIN2.1
N$5
  Top 0.2: U5.8 46.8,27.47 FB1.1
N$6  (via drill 0.3)
  Top 0.2: v63,14 60,14 59.5,14.5 57.5,14.5 57,15 55.5,15 55,14.5 52,14.5 v50.5,15 | v50.5,18.5 51.44,18.5 R10.1
  Bottom 0.2: CH_LED-.TP 64,17.5 63,16.5 v63,14 | v50.5,15 v50.5,18.5
N$7  (via drill 0.3)
  Top 0.2: R10.2 51.38,20.62 v50.5,21.5 | v50.5,23.5 51.75,23.5 U6.1
  Bottom 0.2: v50.5,21.5 v50.5,23.5
N$8
  Top 0.2: U6.5 R11.2
N$9  (via drill 0.3)
  Top 0.2: X2.A5 48.75,12.75 48.5,13 48.5,14.05 56.55,14.05 56.6,14 v56.5,14.25 | R13.2 58,16 v57.5,16.5
  Bottom 0.2: v57.5,16.5 56.5,16.5 56,16 56,15 v56.5,14.25
N$10  (via drill 0.3)
  Top 0.2: X2.B5 51.75,12.25 v51.5,12.5 | v52.5,16.5 56.5,16.5 57,17.5 R12.2
  Bottom 0.2: v51.5,12.5 52.5,13.5 52.5,14 53,14.5 53,16.5 v52.5,16.5
PT1  (via drill 0.3)
  Top 0.2: 30.53,26.97 v30.5,27 31,27 31.5,27.5 34,27.5 34.5,27 36.5,27 37.5,26 39,26 39.47,26.47 U5.5 | v30.5,36.5 31.95,36.5 R9.2
  Bottom 0.2: v30.5,27 v30.5,36.5 30.5,38.5 31,39 PT1.1
PT2  (via drill 0.3)
  Top 0.2: U5.6 44.03,26.47 44,26.5 44,28.5 v43,29.5 | v28,36.5 26.55,36.5 R8.2 | v43,32.5 34.5,32.5 34,32.8 v28,32.8
  Bottom 0.2: PT2.1 27,39 28,38 v28,36.5 v28,32.8 | v43,29.5 v43,32.5
PTREF  (via drill 0.3)
  Top 0.2: IC2.29 38.85,23.15 v38.5,23.5 | v38.5,27 40.99,27 U5.4 | PT2_IN.1 PT1_IN.1 34.5,42.5 35,43 v40,43
  Bottom 0.2: v38.5,23.5 v38.5,27 40,28.5 v40,43
QSPI_CS  (via drill 0.3)
  Top 0.2: U4.1 43.63,16.63 v43.75,16.75 | IC2.20 41.62,19.5 43,19.5 v43.75,20 43.84,19.66 R7.2
  Bottom 0.2: v43.75,16.75 v43.75,20
QSPI_DATA[0]
  Top 0.2: IC2.13 41.5,15.95 42,14 46.95,14 U4.5
QSPI_DATA[1]
  Top 0.2: U4.2 44.13,16.13 43.5,16 42.5,16 42,16.45 IC2.14
QSPI_DATA[2]  (via drill 0.3)
  Top 0.2: IC2.15 42.05,16.95 v42.6,16.85 | v42.6,15.35 43.5,15.35 44,15.5 44.42,15.5 U4.3
  Bottom 0.2: v42.6,16.85 v42.6,15.35
QSPI_DATA[3]
  Top 0.2: U4.7 46.37,16.13 45,17.5 41.62,17.5 IC2.16
QSPI_SCK  (via drill 0.3)
  Top 0.2: U4.6 47.37,15.63 v48,16 | v48,18 46,18 45,19 41.62,19 IC2.19
  Bottom 0.2: v48,16 v48,18
RST_3V  (via drill 0.3)
  Top 0.2: U1.14P 9.35,18.35 13.5,22.5 13.5,29.5 14,30 16,30 17.5,30.8 18.5,30.8 19.5,30 26.5,30 27.5,29 34.5,29 v35.5,28 | IC2.8 38.85,14.65 v39.5,13.85 | v40,12 39.5,12 38.5,12.6 v36,12.6
  Bottom 0.2: v39.5,13.85 39.5,12.5 v40,12 | v36,12.6 36,13.5 35,14.5 35,23 35.5,23.5 35.5,26 35,26.5 35.5,27 v35.5,28
SCK  (via drill 0.3)
  Top 0.2: U1.12P 8.85,22.35 11,24.5 11,31.5 15.5,31.5 16,32 19.5,32 20,31.5 24,31.5 24.5,31 31,31 31.5,30.5 v34.5,30.5 | IC2.2 35.85,13.85 v35,13
  Bottom 0.2: v35,13 35,13.5 34.5,14 34.5,23.5 35,24 35,25.5 34.5,26 v34.5,30.5
SCL  (via drill 0.3)
  Top 0.2: IC2.22 41.95,20.45 42.5,21 42.5,21.5 v44.5,21.5 | U5.10 45.5,28.73 45.5,29 45,29.5 v44.5,29.5 | R1.1 v47,36.5 | U2.5 45.5,34 v47,34
  Bottom 0.2: v44.5,21.5 v44.5,29.5 45.5,31 46.75,32 v47,34 v47,36.5
SDA  (via drill 0.3)
  Top 0.2: IC2.21 42.45,19.95 43,21 44,21 44.5,20.5 45,20.5 v45.5,21 | U5.9 45.97,27.97 46.5,28.5 46.5,29 46,29.5 v46,30 | U2.6 49.77,34.77 v50,35 | v50.5,38 R2.1
  Bottom 0.2: v45.5,21 45.5,22 45,22.5 45,29 v46,30 47.75,31.5 48,33 48.5,33.75 49.75,34 v50,35 50,37.5 v50.5,38
SWCLK  (via drill 0.3)
  Top 0.2: PICLK.TP PCLK.TP | IC2.45 30.95,17.45 30.5,17 v30.5,16.5 | v30.5,10.5 30.66,10.66 R4.2 34.41,10.13 34.26,8.5
  Bottom 0.2: v30.5,10.5 v30.5,16.5
SWDIO  (via drill 0.3)
  Top 0.2: PIIO.TP PIO.TP | IC2.46 32.45,16.95 v32,16.5
  Bottom 0.2: v32,16.5 32.5,16 32.5,10.55 31.21,9.5 PIIO.TP | 31.2,6.22 PIIO.TP
VBAT  (via drill 0.3)
  Top 0.2: D1.A 61.28,33.22 v61.5,33 | 54.2,20.5 C10.1 | 55.3,23.2 v55.5,23
  Top 0.3: U6.3 55.3,23.2 | v56,21 55.5,20.5
  Top 0.4: X1.2 61.97,34.97 60.5,33.5 59.15,33.5 D1.A | v61.5,20.5 55.5,20.5 54.2,20.5
  Bottom 0.3: v55.5,23 55.5,21.5 v56,21
  Bottom 0.4: v61.5,33 v61.5,20.5
VBUS  (via drill 0.3)  (1 unrouted)
  Top 0.2: v52.5,12.5 52.4,12.4 X2.B4A9 52,4 51.5,3.5 48.5,3.5 X2.A4B9 | v54,28 54,25.85 U6.4 | v57,15.7 v54,15.7 | C6.1 59.14,29.25 D1.C 57.75,28.25 55.5,28.25 54.5,29.75 v53.25,31.75 55,32 R3.2 | v59,28.25 60.4,28.5 C6.1 | C6.1 62.04,29.25 CH_LED+.TP | J1.1 v58.5,11.5 | 60.1,26.9 v59.85,27.15
  Top 0.254: U3.1 59.95,26.75 60.07,26.87 60.07,26.9
  Bottom 0.2: v52.5,12.5 53.5,13.5 53.5,14 54,14.5 v54,15.7 v54,28 53.75,31.25 v53.25,31.75 | v58.5,11.5 58.5,14 v57,15.7 | v59.85,27.15 59.75,28 v59,28.25
VDDCORE
  Top 0.2: IC2.41 32.5,19.5 C9.1
(copper drawn outside any net)
  shapes: Bottom area x1

### Text on the board
tNames: GRN.SOLAR / Dec/2022